# EasyEDA Pro project ProProject_四足舵机控制板V2-PCA9685_2024-05-28.epro, schematic schematic1
Create Date: 2024-04-19; Page Name: P1; Project Name: 四足舵机控制板V2-PCA9685; Schematic Name: schematic1; Update Date: 2024-04-24; Company: 嘉立创EDA; Page Size: A4; Version: V1.0
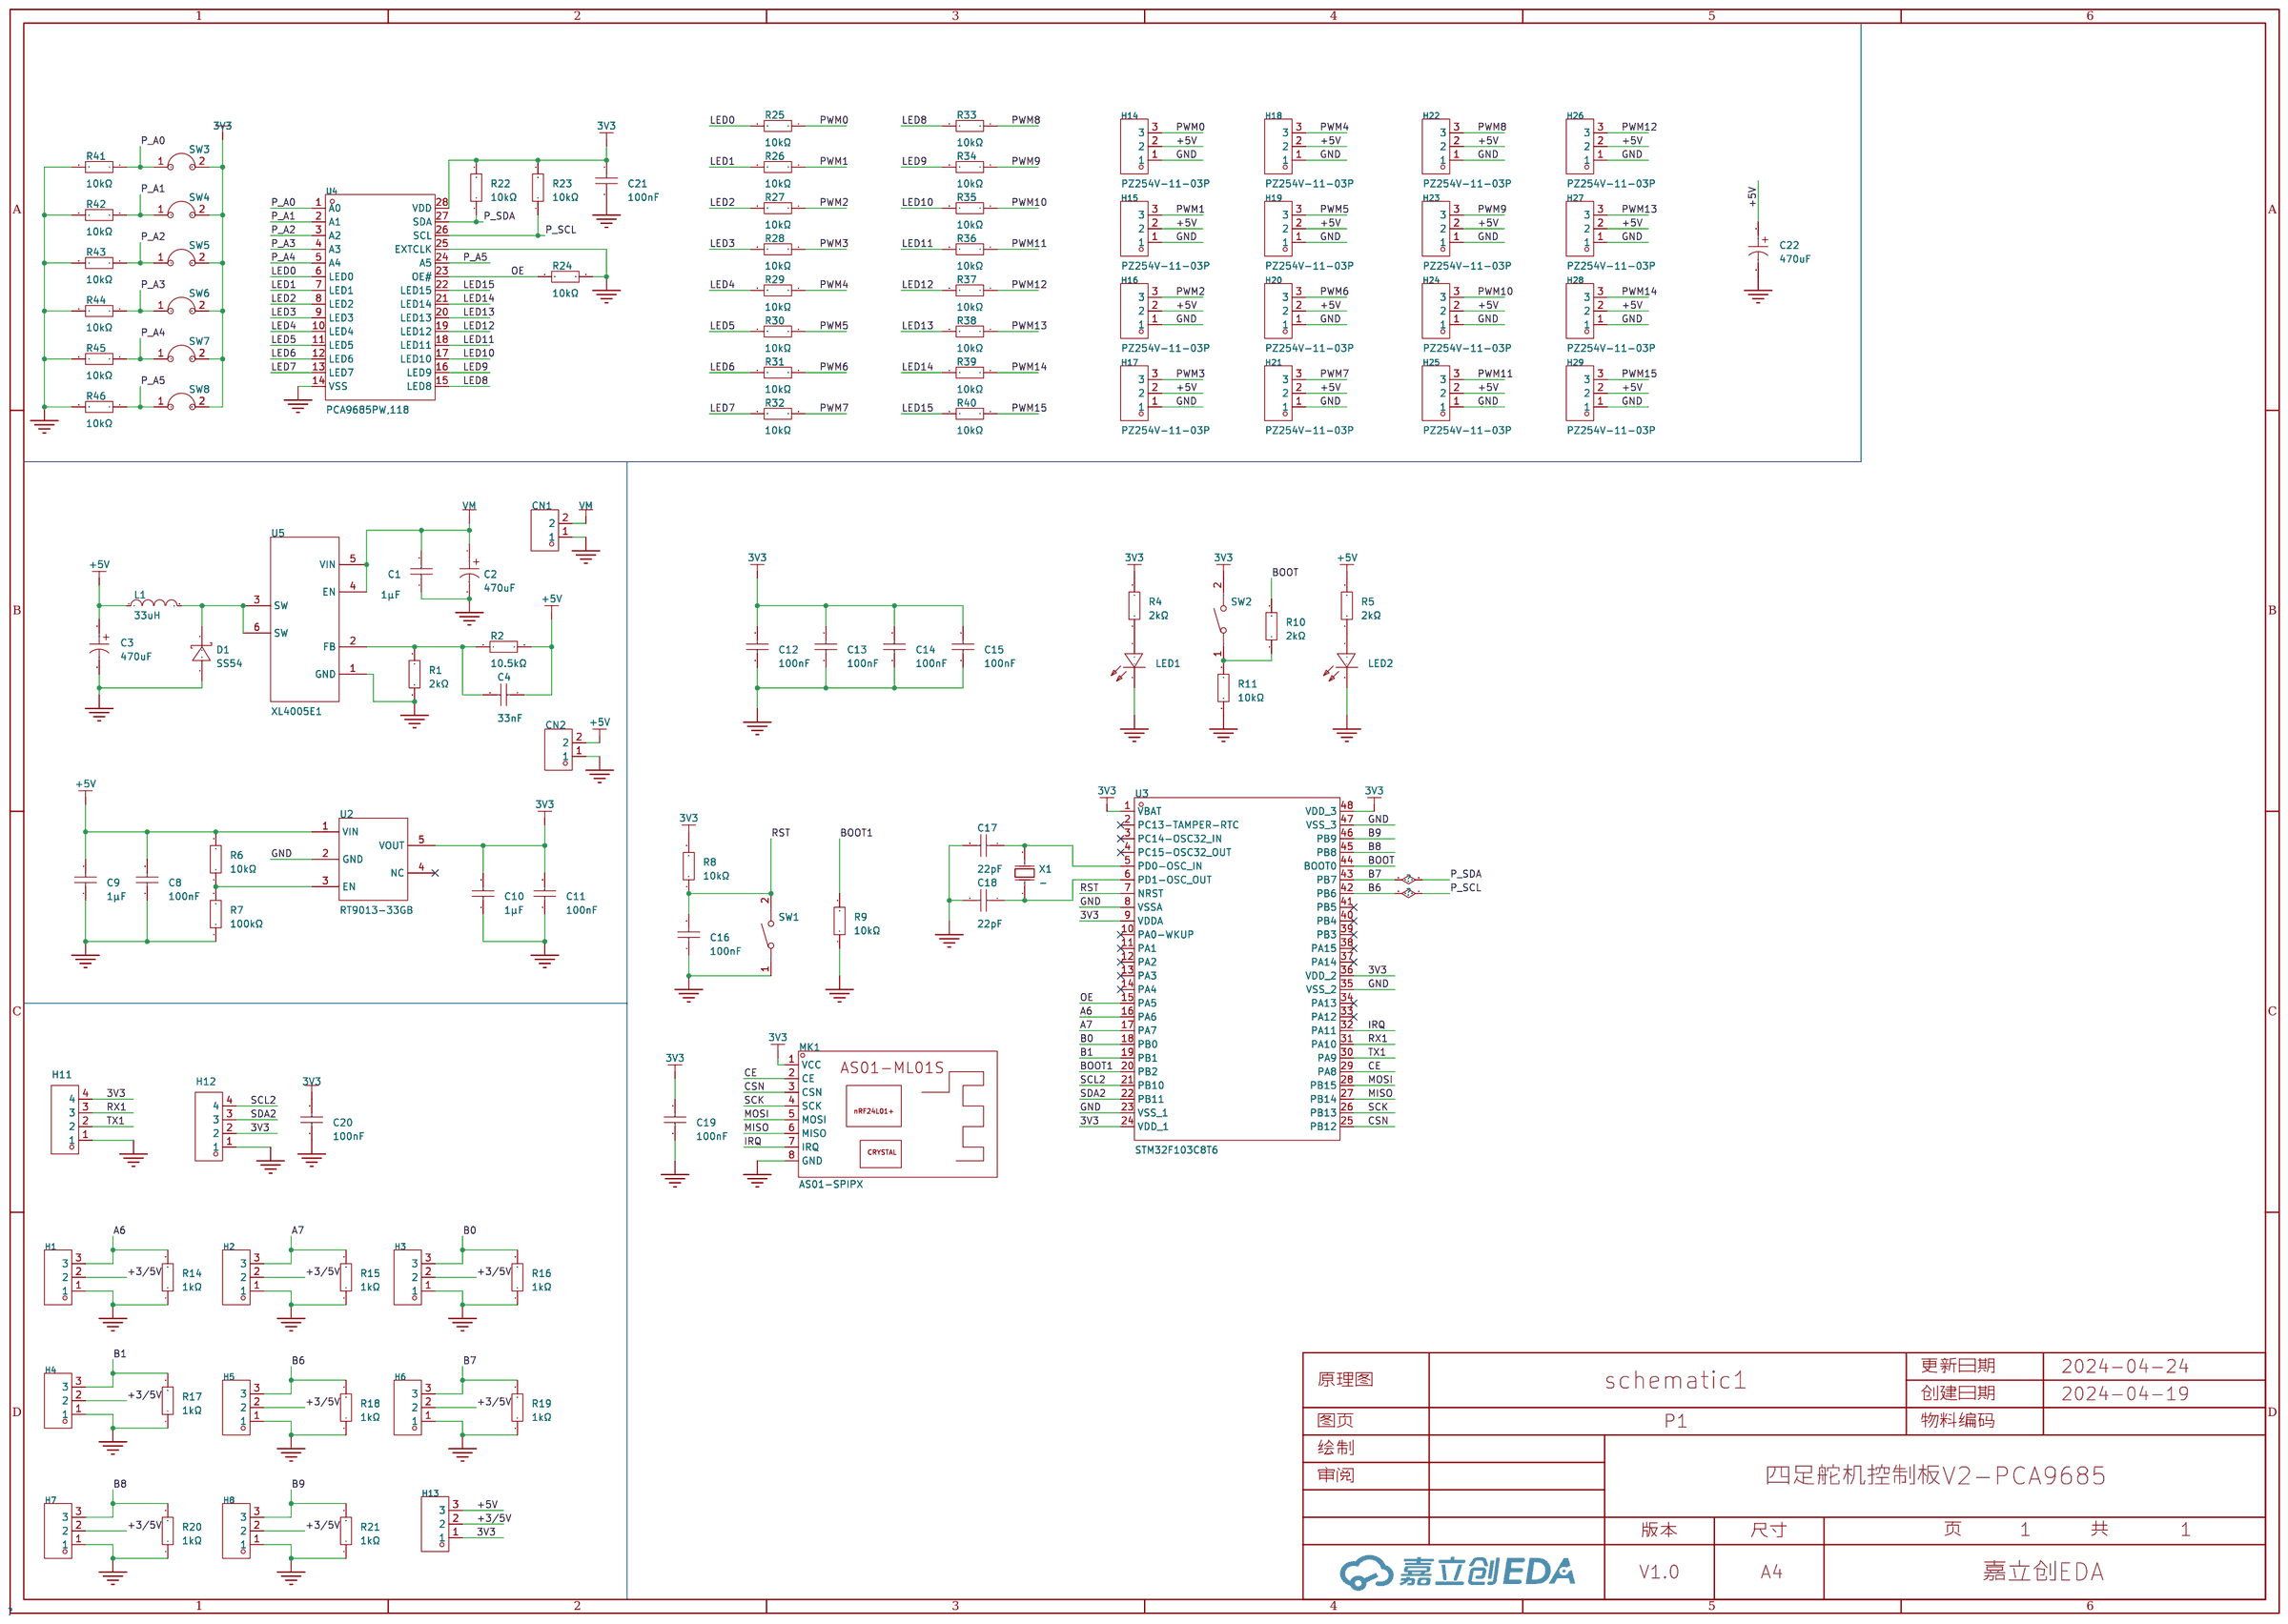
[diagram p0: schematic sheet]

## Parts
C1  1μF  [C1206]
C2  470uF  [CAP-TH_BD10.0-P5.00-D0.6-FD]
C3  470uF  [CAP-TH_BD10.0-P5.00-D0.6-FD]
C4  33nF  [C0805]
C8  100nF  [C0805]
C9  1μF  [C0805]
C10  1μF  [C0805]
C11  100nF  [C0805]
C12  100nF  [C0805]
C13  100nF  [C0805]
C14  100nF  [C0805]
C15  100nF  [C0805]
C16  100nF  [C0805]
C17  22pF  [C0805]
C18  22pF  [C0805]
C19  100nF  [C0805]
C20  100nF  [C0805]
C21  100nF  [C0805]
C22  470uF  [CAP-TH_BD10.0-P5.00-D0.6-FD]
CN1  MX128L-3.81-02P-GN01-Cu-Y-A  [CONN-TH_2P-P3.81_MX128L-3.81-GN01-02P-CU-Y-A]
CN2  MX128L-3.81-02P-GN01-Cu-Y-A  [CONN-TH_2P-P3.81_MX128L-3.81-GN01-02P-CU-Y-A]
D1  SS54  [SMA_L4.4-W2.8-LS5.4-R-RD]
H1  PZ254V-11-03P  [HDR-TH_3P-P2.54-V-M]
H2  PZ254V-11-03P  [HDR-TH_3P-P2.54-V-M]
H3  PZ254V-11-03P  [HDR-TH_3P-P2.54-V-M]
H4  PZ254V-11-03P  [HDR-TH_3P-P2.54-V-M]
H5  PZ254V-11-03P  [HDR-TH_3P-P2.54-V-M]
H6  PZ254V-11-03P  [HDR-TH_3P-P2.54-V-M]
H7  PZ254V-11-03P  [HDR-TH_3P-P2.54-V-M]
H8  PZ254V-11-03P  [HDR-TH_3P-P2.54-V-M]
H11  PZ254V-11-04P  [HDR-TH_4P-P2.54-V-M]
H12  PZ254V-11-04P  [HDR-TH_4P-P2.54-V-M]
H13  PZ254V-11-03P  [HDR-TH_3P-P2.54-V-M]
H14  PZ254V-11-03P  [HDR-TH_3P-P2.54-V-M]
H15  PZ254V-11-03P  [HDR-TH_3P-P2.54-V-M]
H16  PZ254V-11-03P  [HDR-TH_3P-P2.54-V-M]
H17  PZ254V-11-03P  [HDR-TH_3P-P2.54-V-M]
H18  PZ254V-11-03P  [HDR-TH_3P-P2.54-V-M]
H19  PZ254V-11-03P  [HDR-TH_3P-P2.54-V-M]
H20  PZ254V-11-03P  [HDR-TH_3P-P2.54-V-M]
H21  PZ254V-11-03P  [HDR-TH_3P-P2.54-V-M]
H22  PZ254V-11-03P  [HDR-TH_3P-P2.54-V-M]
H23  PZ254V-11-03P  [HDR-TH_3P-P2.54-V-M]
H24  PZ254V-11-03P  [HDR-TH_3P-P2.54-V-M]
H25  PZ254V-11-03P  [HDR-TH_3P-P2.54-V-M]
H26  PZ254V-11-03P  [HDR-TH_3P-P2.54-V-M]
H27  PZ254V-11-03P  [HDR-TH_3P-P2.54-V-M]
H28  PZ254V-11-03P  [HDR-TH_3P-P2.54-V-M]
H29  PZ254V-11-03P  [HDR-TH_3P-P2.54-V-M]
L1  33uH  [IND-SMD_L12.3-W12.3]
LED1  SZYY0603G  [LED0603-R-RD_GREEN]
LED2  SZYY0603G  [LED0603-R-RD_GREEN]
MK1  AS01-SPIPX  [AS01-SPIPX]
R1  2kΩ  [R0603]
R2  10.5kΩ  [R0603]
R4  2kΩ  [R0603]
R5  2kΩ  [R0603]
R6  10kΩ  [R0603]
R7  100kΩ  [R0603]
R8  10kΩ  [R0603]
R9  10kΩ  [R0603]
R10  2kΩ  [R0603]
R11  10kΩ  [R0603]
R14  1kΩ  [R0603]
R15  1kΩ  [R0603]
R16  1kΩ  [R0603]
R17  1kΩ  [R0603]
R18  1kΩ  [R0603]
R19  1kΩ  [R0603]
R20  1kΩ  [R0603]
R21  1kΩ  [R0603]
R22  10kΩ  [R0603]
R23  10kΩ  [R0603]
R24  10kΩ  [R0603]
R25  10kΩ  [R0603]
R26  10kΩ  [R0603]
R27  10kΩ  [R0603]
R28  10kΩ  [R0603]
R29  10kΩ  [R0603]
R30  10kΩ  [R0603]
R31  10kΩ  [R0603]
R32  10kΩ  [R0603]
R33  10kΩ  [R0603]
R34  10kΩ  [R0603]
R35  10kΩ  [R0603]
R36  10kΩ  [R0603]
R37  10kΩ  [R0603]
R38  10kΩ  [R0603]
R39  10kΩ  [R0603]
R40  10kΩ  [R0603]
R41  10kΩ  [R0603]
R42  10kΩ  [R0603]
R43  10kΩ  [R0603]
R44  10kΩ  [R0603]
R45  10kΩ  [R0603]
R46  10kΩ  [R0603]
SW1  TS-1088-AR02016  [SW-SMD_L3.9-W3.0-P4.45]
SW2  TS-1088-AR02016  [SW-SMD_L3.9-W3.0-P4.45]
SW3  TS342A2P-WZ  [R0603]
SW4  TS342A2P-WZ  [R0603]
SW5  TS342A2P-WZ  [R0603]
SW6  TS342A2P-WZ  [R0603]
SW7  TS342A2P-WZ  [R0603]
SW8  TS342A2P-WZ  [R0603]
U2  RT9013-33GB  [SOT-23-5_L3.0-W1.7-P0.95-LS2.8-BL]
U3  STM32F103C8T6  [LQFP-48_L7.0-W7.0-P0.50-LS9.0-BL]
U4  PCA9685PW,118  [TSSOP-28_L9.7-W4.4-P0.65-LS6.4-TL]
U5  XL4005E1  [TO-263-5_L10.2-W9.2-P1.70-TL]
X1  -  [HC-49S_L11.4-W4.8]

## Library data of the parts
C1 = CL31A226KAHNNNE: 容值:22uF;精度:±10%;额定电压:25V;材质(温度系数):X5R;; LCSC Part Name: 22uF ±10% 25V; Supplier Part: C12891; Manufacturer: SAMSUNG(三星); Supplier Footprint: 1206; JLCPCB Part Class: 基础库; Datasheet: https://atta.szlcsc.com/upload/public/pdf/source/20160218/1457707763339.pdf; Supplier: LCSC; Tolerance: ±10%; Voltage Rated: 25V; Temperature Coefficient: X5R
C2 C3 C22 = 01EC1266: 容值:470uF;精度:±20%;额定电压:35V;纹波电流:1A@100kHz;等效串联电阻:200mΩ@100kHz;; LCSC Part Name: 470uF ±20% 35V; Supplier Part: C2831772; Manufacturer: KNSCHA(科尼盛); Supplier Footprint: 插件,D10xL16mm; JLCPCB Part Class: 扩展库; Datasheet: https://atta.szlcsc.com/upload/public/pdf/source/20210507/C2831772_9539BEF506B439DD8F6399C76418E24B.pdf; Supplier: LCSC; Tolerance: ±20%; Rated Voltage: 35V; Ripple Current: 1A@100kHz; Equivalent Series Resistance(ESR): 200mΩ@100kHz; Lead Spacing: 5mm; φD: 10mm; L: 16mm; Lifetime @ Temp: 10000hrs@105℃; Operating Temperature: -55℃~+105℃
C4 C8-C21 = CC0805KRX7R9BB104: 容值:100nF;精度:±10%;额定电压:50V;材质(温度系数):X7R;; LCSC Part Name: 100nF ±10% 50V; Supplier Part: C49678; Manufacturer: YAGEO(国巨); Supplier Footprint: 0805; JLCPCB Part Class: 基础库; Datasheet: https://atta.szlcsc.com/upload/public/pdf/source/20180224/C181747_15194369449651363981.pdf; Supplier: LCSC; Tolerance: ±10%; Voltage Rated: 50V; Temperature Coefficient: X7R
CN1 CN2 = MX128L-3.81-02P-GN01-Cu-Y-A: 结构:1x2P;间距:3.81mm;颜色:绿色;安装方式:直插;额定电流:10A;额定电压:150V;排数:1;线规 - AWG:16~26;线规 - 平方毫米:1.5;每排PIN数:2;触头材质:铜合金;触头镀层:锡;工作温度范围:-40℃~+105℃;; LCSC Part Name: 3.81mm 1x2P 排数:1 每排P数:2 直插; Supplier Part: C5188452; Manufacturer: MAX(迈旭); Supplier Footprint: 插件,P=3.81mm; JLCPCB Part Class: 扩展库; Datasheet: https://atta.szlcsc.com/upload/public/pdf/source/20230914/B6D11694B2EF123065C24316748628EB.pdf; Supplier: LCSC; Structure: 1x2P; Pitch: 3.81mm; Color: 绿色; Mounting Style: 直插; Current Rating (Max): 10A; Voltage Rating (Max): 150V; Number of Pins: 2P; Number of Rows: 1; Wire Gauge - AWG: 16~26; Wire Gauge - mm2: 1.5; Number of PINs Per Row: 2; Contact Material: 铜合金; Contact Plating: 锡; Operating Temperature Range: -40℃~+105℃
D1 = SS54_C22452: 正向压降(Vf):550mV@5A;直流反向耐压(Vr):40V;平均整流电流(Io):5A;; LCSC Part Name: 电压:40V 电流:5A; Supplier Part: C22452; Manufacturer: MDD; Supplier Footprint: SMA(DO-214AC); JLCPCB Part Class: 基础库; Datasheet: https://atta.szlcsc.com/upload/public/pdf/source/20230314/529CD85F9B31F69841D3A079BC07E377.pdf; Supplier: LCSC; Forward Voltage (Vf@If): 550mV@5A; Reverse Voltage (Vr): 40V; Average Rectified Current (Io): 5A; Reverse Leakage Current (Ir): 1mA@40V
H1-H8 H13-H29 = PZ254V-11-03P: 插针结构:1x3P;间距:2.54mm;行距:-;圆针/方针:方针;安装类型:直插;排数:单排;总PIN位数:3P;额定电流:3A;额定电压:250V;配合针长度:6mm;塑高:2.5mm;端接针长度:3mm;工作温度范围:-40℃~+105℃;颜色:黑色;; LCSC Part Name: 间距:2.54mm 1x3P 直插 方针; Supplier Part: C2937625; Manufacturer: XFCN(兴飞); Supplier Footprint: 插件,P=2.54mm; JLCPCB Part Class: 扩展库; Datasheet: https://atta.szlcsc.com/upload/public/pdf/source/20200309/C492402_8335C3D49C4E4C618838D59BB1D024C1.pdf; Supplier: LCSC; Pin Structure: 1x3P; Pitch: 2.54mm; Circluar Pins/Square Pins: 方针; Mounting Type: 直插; Number of Rows: 单排; Number of Pins: 3P; Current Rating (Max): 3A; Voltage Rating (Max): 250V; Length of Mating Pin: 6mm; Insulation Height: 2.5mm; Length of End Connection Pin: 3mm; Operating Temperature Range: -40℃~+105℃; Color: 黑色
H11 H12 = PZ254V-11-04P: 插针结构:1x4P;间距:2.54mm;行距:-;圆针/方针:方针;安装类型:直插;排数:单排;总PIN位数:4P;额定电流:3A;额定电压:250V;配合针长度:6mm;塑高:2.5mm;端接针长度:3mm;触头材质:-;工作温度范围:-40℃~+105℃;颜色:黑色;; LCSC Part Name: 间距:2.54mm 1x4P 直插 方针; Supplier Part: C2691448; Manufacturer: XFCN(兴飞); Supplier Footprint: 插件,P=2.54mm; JLCPCB Part Class: 扩展库; Datasheet: https://atta.szlcsc.com/upload/public/pdf/source/20200309/C492403_F9F19131791D08044AD4F84F8E751A34.pdf; Supplier: LCSC; Pin Structure: 1x4P; Pitch: 2.54mm; Circluar Pins/Square Pins: 方针; Mounting Type: 直插; Number of Rows: 单排; Number of Pins: 4P; Current Rating (Max): 3A; Voltage Rating (Max): 250V; Length of Mating Pin: 6mm; Insulation Height: 2.5mm; Length of End Connection Pin: 3mm; Operating Temperature Range: -40℃~+105℃; Color: 黑色
L1 = SMDRI127-330MT: 电感值:33uH;精度:±20%;额定电流:3A;饱和电流(Isat):5.5A;类型:屏蔽电感;; LCSC Part Name: 33uH ±20% 5.5A; Supplier Part: C9400; Manufacturer: SXN(顺翔诺); Supplier Footprint: SMD; JLCPCB Part Class: 扩展库; Datasheet: https://atta.szlcsc.com/upload/public/pdf/source/20210810/6F96FDC19AA308DD2AD166FFB9640E87.pdf; Supplier: LCSC; Tolerance: ±20%; Rated Current: 3A; Saturation Current (Isat): 5.5A; DC Resistance (DCR): 65mΩ; Type: 屏蔽电感
LED1 LED2 = SZYY0603G: 发光颜色:翠绿色;; LCSC Part Name: 翠绿; Supplier Part: C434420; Manufacturer: yongyu(永裕光电); Supplier Footprint: 0603; JLCPCB Part Class: 扩展库; Datasheet: https://atta.szlcsc.com/upload/public/pdf/source/20191204/C434420_28D8AC31297B1E2177F31D28DAFFED5A.pdf; Supplier: LCSC; Emitted Color: 翠绿色
MK1 = AS01-ML01S: 工业级、高稳定性、挪威原产芯片nRF24L01P的2.4G无线模块; Supplier: LCSC; Manufacturer: Ashining(泽耀科技); Supplier Part: C84802; JLCPCB Part Class: 扩展库; LCSC Part Name: 挪威原产芯片nRF24L01+无线模块; Supplier Footprint: SMD; Datasheet: https://atta.szlcsc.com/upload/public/pdf/source/20161024/1477288672332.pdf
R1 R2 R4-R11 R14-R46 = 0603WAF1001T5E: 电阻类型:厚膜电阻;阻值:1kΩ;精度:±1%;功率:100mW;最大工作电压:75V;温度系数:±100ppm/℃;; LCSC Part Name: 1kΩ ±1% 100mW 厚膜电阻; Supplier Part: C21190; Manufacturer: UNI-ROYAL(厚声); Supplier Footprint: 0603; JLCPCB Part Class: 基础库; Datasheet: https://atta.szlcsc.com/upload/public/pdf/source/20200306/C422600_1E6D84923E4A46A82E41ADD87F860B5C.pdf; Supplier: LCSC; Type: 厚膜电阻; Tolerance: ±1%; Power(Watts): 100mW; Overload Voltage (Max): 75V; Temperature Coefficient: ±100ppm/℃; Operating Temperature Range: -55℃~+155℃
SW1 SW2 = TS-1088-AR02016: 电路结构:单刀单掷;按钮形状:圆形按钮;作用力:160gf;安装方式:立贴;开关长度:4mm;开关宽度:3mm;开关高度:2mm;带支架:不带;触点电流:50mA;额定电压(DC):12V;绝缘电阻:100MΩ;机械寿命:10万次;; LCSC Part Name: 4*3*2mm 立贴 轻触开关; Supplier Part: C720477; Manufacturer: XUNPU(讯普); Supplier Footprint: SMD; JLCPCB Part Class: 扩展库; Datasheet: https://atta.szlcsc.com/upload/public/pdf/source/20200810/C720475_60D09DD6C54279ADDB2DC25100F1CC11.pdf; Supplier: LCSC; Circuit: 单刀单掷; Actuator Style: 圆形按钮; Operating Force: 160gf; Mounting Style: 立贴; Switch Length: 4mm; Switch Width: 3mm; Switch Height: 2mm; Strike Gundam: 不带; Contact Current: 50mA; Voltage Rating (DC): 12V; Insulation Resistance: 100MΩ; Actuator/Cap Color: 黑色; Pin Style: SMD接片; Mechanical Life: 10万次; Operating Temperature: -30℃~+80℃
SW3-SW8 = TS342A2P-WZ: 电路结构:单刀单掷;按钮形状:圆形按钮;安装方式:立贴;开关长度:3.95mm;开关宽度:2.9mm;开关高度:2mm;带支架:不带;触点电流:50mA;额定电压(DC):12V;绝缘电阻:100MΩ;机械寿命:3万次;; Supplier: LCSC; Supplier Part: C557591; Manufacturer: SHOU HAN(首韩); JLCPCB Part Class: 扩展库; LCSC Part Name: 3.95*2.9*2mm 立贴 轻触开关; Supplier Footprint: SMD; Datasheet: https://atta.szlcsc.com/upload/public/pdf/source/20200519/C557591_B3A5A21584733303F06306F18577DA8B.pdf; Circuit: 单刀单掷; Actuator Style: 圆形按钮; Mounting Style: 立贴; Switch Length: 3.95mm; Switch Width: 2.9mm; Switch Height: 2mm; Strike Gundam: 不带; Contact Current: 50mA; Voltage Rating (DC): 12V; Insulation Resistance: 100MΩ; Actuator/Cap Color: 黑色; Pin Style: SMD接片; Mechanical Life: 3万次; Operating Temperature: -25℃~+70℃
U2 = RT9013-33GB: 输出类型:固定;最大输入电压:5.5V;输出电压:3.3V;最大输出电流:500mA;电源纹波抑制比(PSRR):50dB@(10kHz);输出极性:正极;; LCSC Part Name: 输入5.5V 输出3.3V 500mA; Supplier Part: C47773; Manufacturer: RICHTEK(立锜); Supplier Footprint: SOT-23-5; JLCPCB Part Class: 扩展库; Datasheet: https://atta.szlcsc.com/upload/public/pdf/source/20150504/1457707282459.pdf; Supplier: LCSC; Output Type: 固定; Maximum Input Voltage: 5.5V; Output Voltage: 3.3V; MAX Output Current: 500mA; Power Supply Rejection Ratio (PSRR): 50dB@(10kHz); Dropout Voltage: 400mV@(500mA); standby current: 50uA; Operating Temperature: -40℃~+85℃; Output Polarity: 正极; Number of Outputs: 1
U3 = STM32F103C8T6: CPU内核:CM3;程序存储容量:64KB;RAM总容量:20KB;GPIO端口数量:37;工作电压范围:2V~3.6V;CPU最大主频:72MHz;程序存储器类型:FLASH;; LCSC Part Name: STM32F103C8T6 MSL=3; Supplier Part: C8734; Manufacturer: ST(意法半导体); Supplier Footprint: LQFP-48(7x7); JLCPCB Part Class: 扩展库; Datasheet: https://atta.szlcsc.com/upload/public/pdf/source/20220812/8363ACEC51AD55ECEB84799464F7CB85.pdf; Supplier: LCSC; CPU Core: CM3; Program Storage Size: 64KB; RAM Size: 20KB; GPIO Ports Number: 37; Operating Voltage Range: 2V~3.6V; CPU Maximum Speed: 72MHz; Program Memory Type: FLASH; Operating Temperature Range: -40℃~+85℃; ADC (Bit): 12bit; Universal Serial Bus: 有; Peripheral/Function: 看门狗；DMA；看门狗；片载温度传感器; Watchdog: 有; Infrared Data Association: 有; Low-Voltage Detect: 有; Direct Memory Access: 有; Internal Oscillator: 有
U4 = PCA9685PW,118: 类型:-;输入电压:2.3V~5.5V;开关频率:100kHz~1MHz;通道数:16;输出电压:5.5V;输出电流:25mA;调光:PWM;; Supplier Part: C2678753; Manufacturer: NXP(恩智浦); Supplier Footprint: TSSOP-28; JLCPCB Part Class: 扩展库; Datasheet: https://atta.szlcsc.com/upload/public/pdf/source/20170908/C92206_1504870161626958140.pdf; Supplier: LCSC; Input Voltage: 2.3V~5.5V; Switch Frequency: 100kHz~1MHz; Channels: 16; Output Voltage: 5.5V; Output Current: 25mA; Dimming: PWM; Operating temperature: -40℃~+85℃
U5 = XL4005E1: 功能类型:降压型;输入电压:5V~32V;输出电压:800mV~30V;输出电流(最大值):5A;; Supplier Part: C73332; Manufacturer: XLSEMI(芯龙); Supplier Footprint: TO-263-5; JLCPCB Part Class: 扩展库; Datasheet: https://atta.szlcsc.com/upload/public/pdf/source/20160514/1463194849752.pdf; Supplier: LCSC; Function: 降压型; Input Voltage: 5V~32V; Output Voltage: 800mV~30V; Output Current (Max): 5A; Switching Frequency: 300kHz; Synchronous Rectification: 否; Number of Outputs: 1; Topology: 降压式; Switch tube (built-in/external): 内置
X1 = 9C08000003: 晶振类型:-;频率:-;外接负载电容:-;; LCSC Part Name: HC-49SMD 8M 20pF 20ppm; Supplier Part: C90937; Manufacturer: TXC(晶技); Supplier Footprint: HC-49S-SMD; JLCPCB Part Class: 扩展库; Datasheet: https://atta.szlcsc.com/upload/public/pdf/source/20180620/C97215_B58DD94CBE95359F5BF09D54E0633036.pdf; Supplier: LCSC

## Nets
3V3: C10.2 C11.2 C12.2 C13.2 C14.2 C15.2 C19.2 C20.2 C21.1 H11.4 H12.2 H13.1 MK1.1(VCC) R4.2 R8.2 R22.2 R23.2 SW2.2 SW3.2 SW4.2 SW5.2 SW6.2 SW7.2 SW8.2 U2.5(VOUT) U3.1(VBAT) U3.9(VDDA) U3.24(VDD_1) U3.36(VDD_2) U3.48(VDD_3) U4.28(VDD)
+3/5V: H1.2 H2.2 H3.2 H4.2 H5.2 H6.2 H7.2 H8.2 H13.2
+5V: C3.1 C4.1 C8.2 C9.2 C22.1 CN2.2 H13.3 H14.2 H15.2 H16.2 H17.2 H18.2 H19.2 H20.2 H21.2 H22.2 H23.2 H24.2 H25.2 H26.2 H27.2 H28.2 H29.2 L1.1 R2.2 R5.2 R6.2 U2.1(VIN)
GND: C1.1 C2.2 C3.2 C8.1 C9.1 C10.1 C11.1 C12.1 C13.1 C14.1 C15.1 C16.1 C17.2 C18.2 C19.1 C20.1 C21.2 C22.2 CN1.1 CN2.1 D1.1(A) H1.1 H2.1 H3.1 H4.1 H5.1 H6.1 H7.1 H8.1 H11.1 H12.1 H14.1 H15.1 H16.1 H17.1 H18.1 H19.1 H20.1 H21.1 H22.1 H23.1 H24.1 H25.1 H26.1 H27.1 H28.1 H29.1 LED1.2(-) LED2.2(-) MK1.8(GND) R1.2 R7.1 R9.1 R11.1 R14.1 R15.1 R16.1 R17.1 R18.1 R19.1 R20.1 R21.1 R24.1 R41.2 R42.2 R43.2 R44.2 R45.2 R46.2 SW1.1 U2.2(GND) U3.8(VSSA) U3.23(VSS_1) U3.35(VSS_2) U3.47(VSS_3) U4.14(VSS) U4.25(EXTCLK) U5.1(GND)
A6: H1.3 R14.2 U3.16(PA6)
A7: H2.3 R15.2 U3.17(PA7)
B0: H3.3 R16.2 U3.18(PB0)
B1: H4.3 R17.2 U3.19(PB1)
B6: H5.3 R18.2 R23.1 U3.42(PB6) U4.26(SCL)
B7: H6.3 R19.2 R22.1 U3.43(PB7) U4.27(SDA)
B8: H7.3 R20.2 U3.45(PB8)
B9: H8.3 R21.2 U3.46(PB9)
BOOT: R10.2 U3.44(BOOT0)
BOOT1: R9.2 U3.20(PB2)
CE: MK1.2(CE) U3.29(PA8)
CSN: MK1.3(CSN) U3.25(PB12)
IRQ: MK1.7(IRQ) U3.32(PA11)
LED0: R25.2 U4.6(LED0)
LED1: R26.2 U4.7(LED1)
LED2: R27.2 U4.8(LED2)
LED3: R28.2 U4.9(LED3)
LED4: R29.2 U4.10(LED4)
LED5: R30.2 U4.11(LED5)
LED6: R31.2 U4.12(LED6)
LED7: R32.2 U4.13(LED7)
LED8: R33.2 U4.15(LED8)
LED9: R34.2 U4.16(LED9)
LED10: R35.2 U4.17(LED10)
LED11: R36.2 U4.18(LED11)
LED12: R37.2 U4.19(LED12)
LED13: R38.2 U4.20(LED13)
LED14: R39.2 U4.21(LED14)
LED15: R40.2 U4.22(LED15)
MISO: MK1.6(MISO) U3.27(PB14)
MOSI: MK1.5(MOSI) U3.28(PB15)
OE: R24.2 U3.15(PA5) U4.23(OE#)
P_A0: R41.1 SW3.1 U4.1(A0)
P_A1: R42.1 SW4.1 U4.2(A1)
P_A2: R43.1 SW5.1 U4.3(A2)
P_A3: R44.1 SW6.1 U4.4(A3)
P_A4: R45.1 SW7.1 U4.5(A4)
P_A5: R46.1 SW8.1 U4.24(A5)
PWM0: H14.3 R25.1
PWM1: H15.3 R26.1
PWM2: H16.3 R27.1
PWM3: H17.3 R28.1
PWM4: H18.3 R29.1
PWM5: H19.3 R30.1
PWM6: H20.3 R31.1
PWM7: H21.3 R32.1
PWM8: H22.3 R33.1
PWM9: H23.3 R34.1
PWM10: H24.3 R35.1
PWM11: H25.3 R36.1
PWM12: H26.3 R37.1
PWM13: H27.3 R38.1
PWM14: H28.3 R39.1
PWM15: H29.3 R40.1
RST: C16.2 R8.1 SW1.2 U3.7(NRST)
RX1: H11.3 U3.31(PA10)
SCK: MK1.4(SCK) U3.26(PB13)
SCL2: H12.4 U3.21(PB10)
SDA2: H12.3 U3.22(PB11)
TX1: H11.2 U3.30(PA9)
VM: C1.2 C2.1 CN1.2 U5.4(EN) U5.5(VIN)
$1N1468: R6.1 R7.2 U2.3(EN)
$1N2320: LED1.1(+) R4.1
$1N2563: R10.1 R11.2 SW2.1
$1N2663: LED2.1(+) R5.1
$1N3311: C18.1 U3.6(PD1-OSC_OUT) X1.1(OSC1)
$1N3317: C17.1 U3.5(PD0-OSC_IN) X1.2(OSC2)
$1N23767: C4.2 R1.1 R2.1 U5.2(FB)
$1N27161: D1.2(K) L1.2 U5.3(SW) U5.6(SW)

Not connected (* = marked no-connect by the designer): U2 4(NC)*; U3 2(PC13-TAMPER-RTC)* 3(PC14-OSC32_IN)* 4(PC15-OSC32_OUT)* 10(PA0-WKUP)* 11(PA1)* 12(PA2)* 13(PA3)* 14(PA4)* 33(PA12)* 34(PA13)* 37(PA14)* 38(PA15)* 39(PB3)* 40(PB4)* 41(PB5)*
